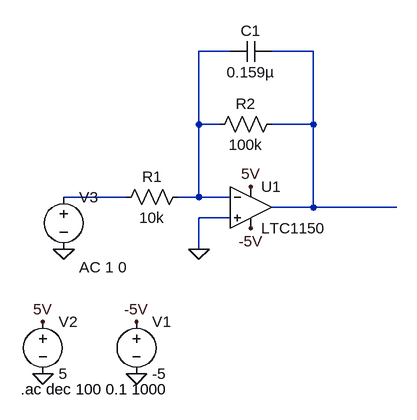
[diagram p0: schematic Active_Low_Pass_Filter.asc]
Active_Low_Pass_Filter.asc, the LTspice schematic file:
Version 4
SHEET 1 880 680
WIRE 144 -80 96 -80
WIRE 272 -80 208 -80
WIRE 96 32 96 -80
WIRE 128 32 96 32
WIRE 272 32 272 -80
WIRE 272 32 208 32
WIRE -16 144 -112 144
WIRE 96 144 96 32
WIRE 96 144 64 144
WIRE 144 144 96 144
WIRE 272 160 272 32
WIRE 272 160 208 160
WIRE 400 160 272 160
WIRE 144 176 96 176
WIRE 96 224 96 176
FLAG 0 416 0
FLAG -144 416 0
FLAG -112 224 0
FLAG 96 224 0
FLAG -144 336 5V
FLAG 176 128 5V
FLAG 0 336 -5V
FLAG 176 192 -5V
SYMBOL OpAmps\\LTC1150 176 96 R0
SYMATTR InstName U1
SYMBOL voltage 0 320 R0
WINDOW 123 0 0 Left 0
WINDOW 39 0 0 Left 0
SYMATTR InstName V1
SYMATTR Value -5
SYMBOL voltage -144 320 R0
WINDOW 123 0 0 Left 0
WINDOW 39 0 0 Left 0
SYMATTR InstName V2
SYMATTR Value 5
SYMBOL voltage -112 128 R0
WINDOW 123 24 124 Left 2
WINDOW 39 0 0 Left 0
SYMATTR InstName V3
SYMATTR Value ""
SYMATTR Value2 AC 1 0
SYMBOL res 80 128 R90
WINDOW 0 0 56 VBottom 2
WINDOW 3 32 56 VTop 2
SYMATTR InstName R1
SYMATTR Value 10k
SYMBOL res 224 16 R90
WINDOW 0 0 56 VBottom 2
WINDOW 3 32 56 VTop 2
SYMATTR InstName R2
SYMATTR Value 100k
SYMBOL cap 208 -96 R90
WINDOW 0 0 32 VBottom 2
WINDOW 3 32 32 VTop 2
SYMATTR InstName C1
SYMATTR Value 0.159µ
TEXT -178 440 Left 2 !.ac dec 100 0.1 1000

The netlist it stands for:
* Active_Low_Pass_Filter.asc
XU1 0 N001 5V -5V N002 LTC1150  ; pins In+ In- V+ V- OUT
V1 -5V 0 -5
V2 5V 0 5
V3 N003 0 AC 1 0
R1 N001 N003 10k
R2 N002 N001 100k
C1 N002 N001 0.159µ
.ac dec 100 0.1 1000
.lib LTC.lib
.backanno
.end